# EAGLE design pcb_btt_tmc_2209 (EAGLE 9.6.2)

## Sheet 1 of 4: ESP32
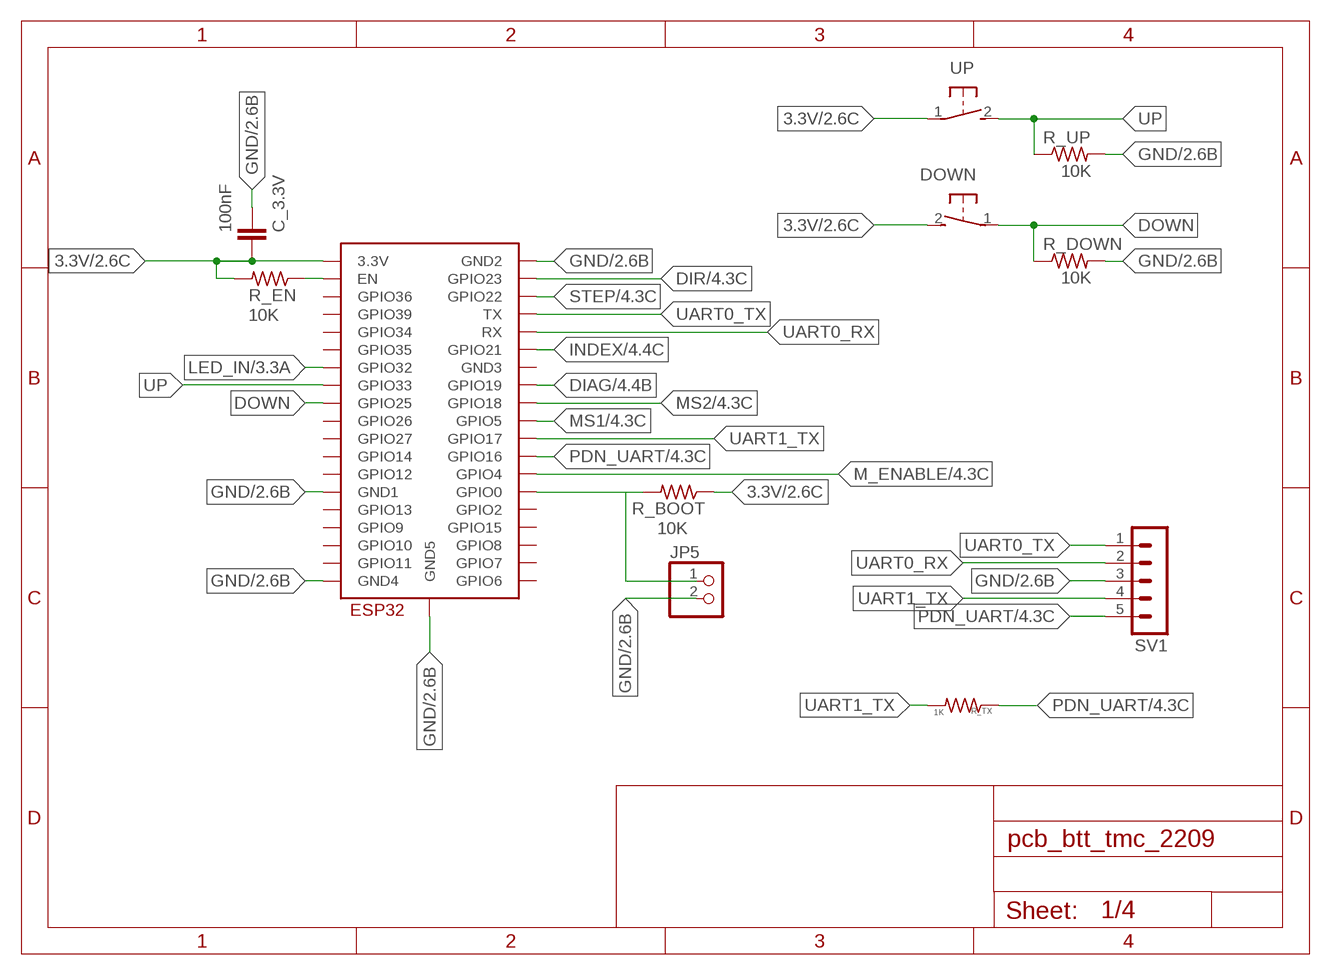
[diagram p0: schematic, sheet 1]

### Parts
C_3.3V  100nF  C-EUC0805K  [C0805K]
DOWN  31-XX  [B3F-31XX]
JP5  PINHD-1X2  [1X02]
R_BOOT  10K  R-US_R0805  [R0805]
R_DOWN  10K  R-US_R0805  [R0805]
R_EN  10K  R-US_R0805  [R0805]
R_TX  1K  R-US_R0805  [R0805]
R_UP  10K  R-US_R0805  [R0805]
SV1  MA05-1  [MA05-1]
U$2  ESP32-WROOM  [ESP32-WROOM]
UP  31-XX  [B3F-31XX]

### Nets
3.3V: C_3.3V.2 DOWN.2(S) R_BOOT.1 R_EN.2 U$2.3V3(3.3V) UP.1(P) ; also sheet 2
DIAG: U$2.IO19(GPIO19) ; also sheet 4
DIR: U$2.IO23(GPIO23) ; also sheet 4
DOWN: DOWN.1(P) R_DOWN.1 U$2.IO25(GPIO25)
GND: C_3.3V.1 JP5.2 R_DOWN.2 R_UP.2 SV1.3 U$2.GND1 U$2.GND2 U$2.GND4 U$2.GND5 ; also sheet 2,3,4
INDEX: U$2.IO21(GPIO21) ; also sheet 4
LED_IN: U$2.IO32(GPIO32) ; also sheet 3
M_ENABLE: U$2.IO4(GPIO4) ; also sheet 4
MS1: U$2.IO5(GPIO5) ; also sheet 4
MS2: U$2.IO18(GPIO18) ; also sheet 4
N$3: JP5.1 R_BOOT.2 U$2.IO0(GPIO0)
N$10: R_EN.1 U$2.EN
PDN_UART: R_TX.1 SV1.5 U$2.IO16(GPIO16) ; also sheet 4
STEP: U$2.IO22(GPIO22) ; also sheet 4
UART0_RX: SV1.2 U$2.RX
UART0_TX: SV1.1 U$2.TX
UART1_TX: R_TX.2 SV1.4 U$2.IO17(GPIO17)
UP: R_UP.1 U$2.IO33(GPIO33) UP.2(S)
Unconnected: U$2.CLK(GPIO6) U$2.CMD(GPIO11) U$2.GND3 U$2.IO2(GPIO2) U$2.IO12(GPIO12) U$2.IO13(GPIO13) U$2.IO14(GPIO14) U$2.IO15(GPIO15) U$2.IO26(GPIO26) U$2.IO27(GPIO27) U$2.IO34(GPIO34) U$2.IO35(GPIO35) U$2.SD0(GPIO7) U$2.SD1(GPIO8) U$2.SD2(GPIO9) U$2.SD3(GPIO10) U$2.SENSOR_VN(GPIO39) U$2.SENSOR_VP(GPIO36)

## Sheet 2 of 4: Power Supply
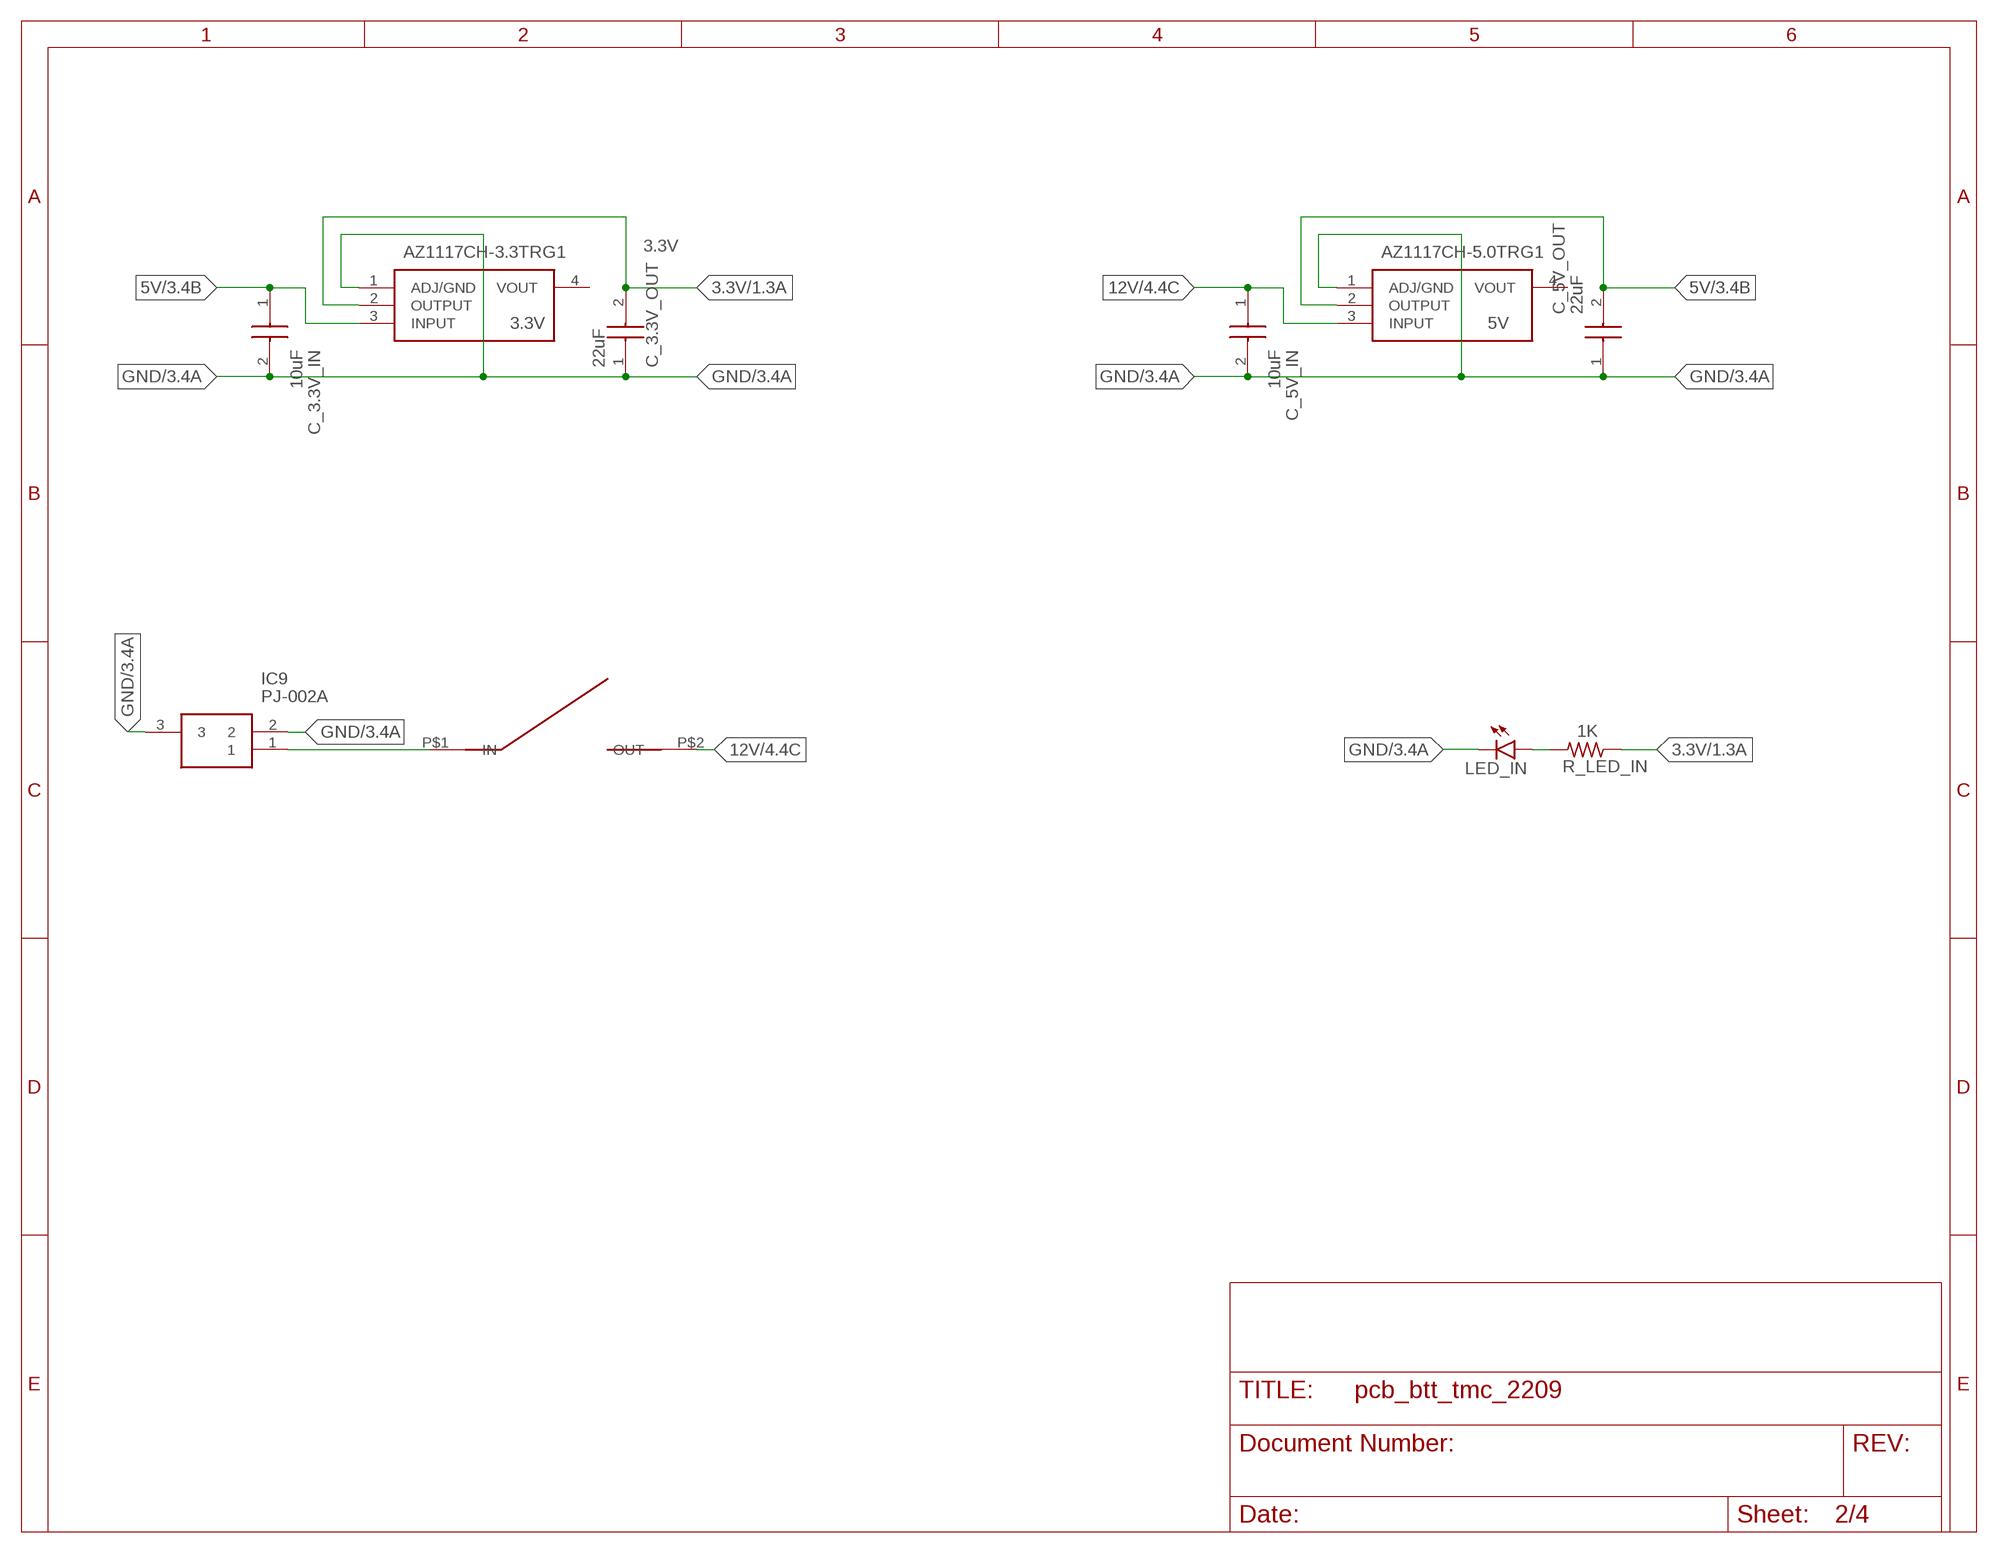
[diagram p1: schematic, sheet 2]

### Parts
3.3V  AZ1117CH-3.3TRG1  [SOT230P700X180-4N]
5V  AZ1117CH-5.0TRG1  [SOT230P700X180-4N]
C_3.3V_IN  10uF  EMK212ABJ106KD-T  [CAPC2013X95N]
C_3.3V_OUT  22uF  CL31A226MOCLNNC  [CAPC3216X100N]
C_5V_IN  10uF  EMK212ABJ106KD-T  [CAPC2013X95N]
C_5V_OUT  22uF  CL31A226MOCLNNC  [CAPC3216X100N]
IC9  PJ-002A  [PJ002A]
LED_IN  LEDSML0805  [SML0805]
R_LED_IN  1K  R-US_R0805  [R0805]
U$1  SPSTROCKERSWITCH2PIN  [SPST2PINROCKER]

### Nets
3.3V: 3.3V.2(OUTPUT) C_3.3V_OUT.2 R_LED_IN.1 ; also sheet 1
5V: 3.3V.3(INPUT) 5V.2(OUTPUT) C_3.3V_IN.1 C_5V_OUT.2 ; also sheet 3,4
12V: 5V.3(INPUT) C_5V_IN.1 U$1.P$2(OUT) ; also sheet 4
GND: 3.3V.1(ADJ/GND) 5V.1(ADJ/GND) C_3.3V_IN.2 C_3.3V_OUT.1 C_5V_IN.2 C_5V_OUT.1 IC9.2 IC9.3 LED_IN.C ; also sheet 1,3,4
N$1: IC9.1 U$1.P$1(IN)
N$2: LED_IN.A R_LED_IN.2
Unconnected: 3.3V.4(VOUT) 5V.4(VOUT)

## Sheet 3 of 4: LED/LEVELSHIFTER
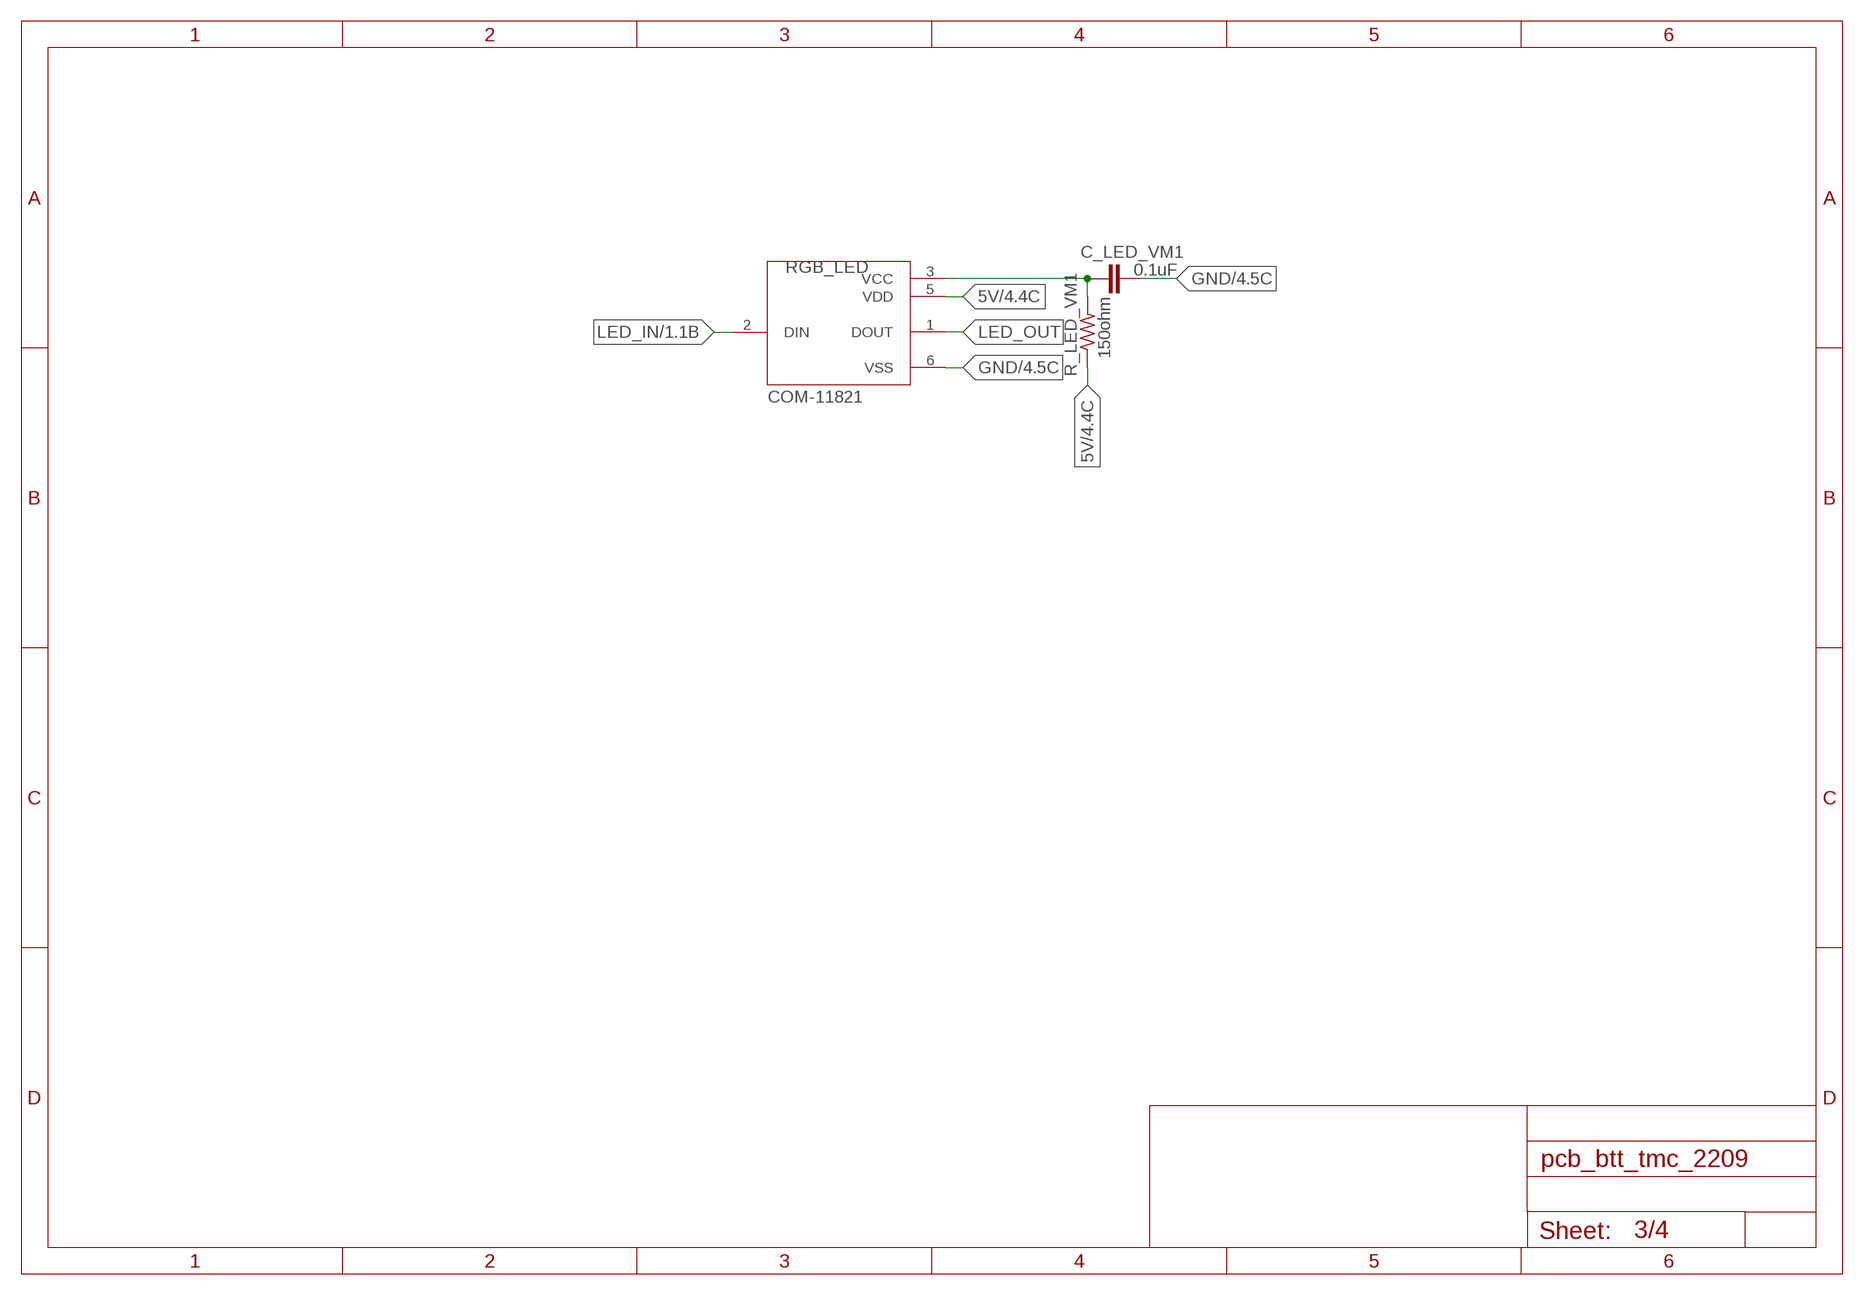
[diagram p2: schematic, sheet 3]

### Parts
C_LED_VM1  0.1uF  C-EUC0805K  [C0805K]
R_LED_VM1  150ohm  R-US_R0805  [R0805]
RGB_LED  COM-11821  [LED_COM-11821]

### Nets
5V: R_LED_VM1.1 RGB_LED.5(VDD) ; also sheet 2,4
GND: C_LED_VM1.2 RGB_LED.6(VSS) ; also sheet 1,2,4
LED_IN: RGB_LED.2(DIN) ; also sheet 1
LED_OUT: RGB_LED.1(DOUT)
N$4: C_LED_VM1.1 R_LED_VM1.2 RGB_LED.3(VCC)

## Sheet 4 of 4: BTT MODULE TMC2209LA
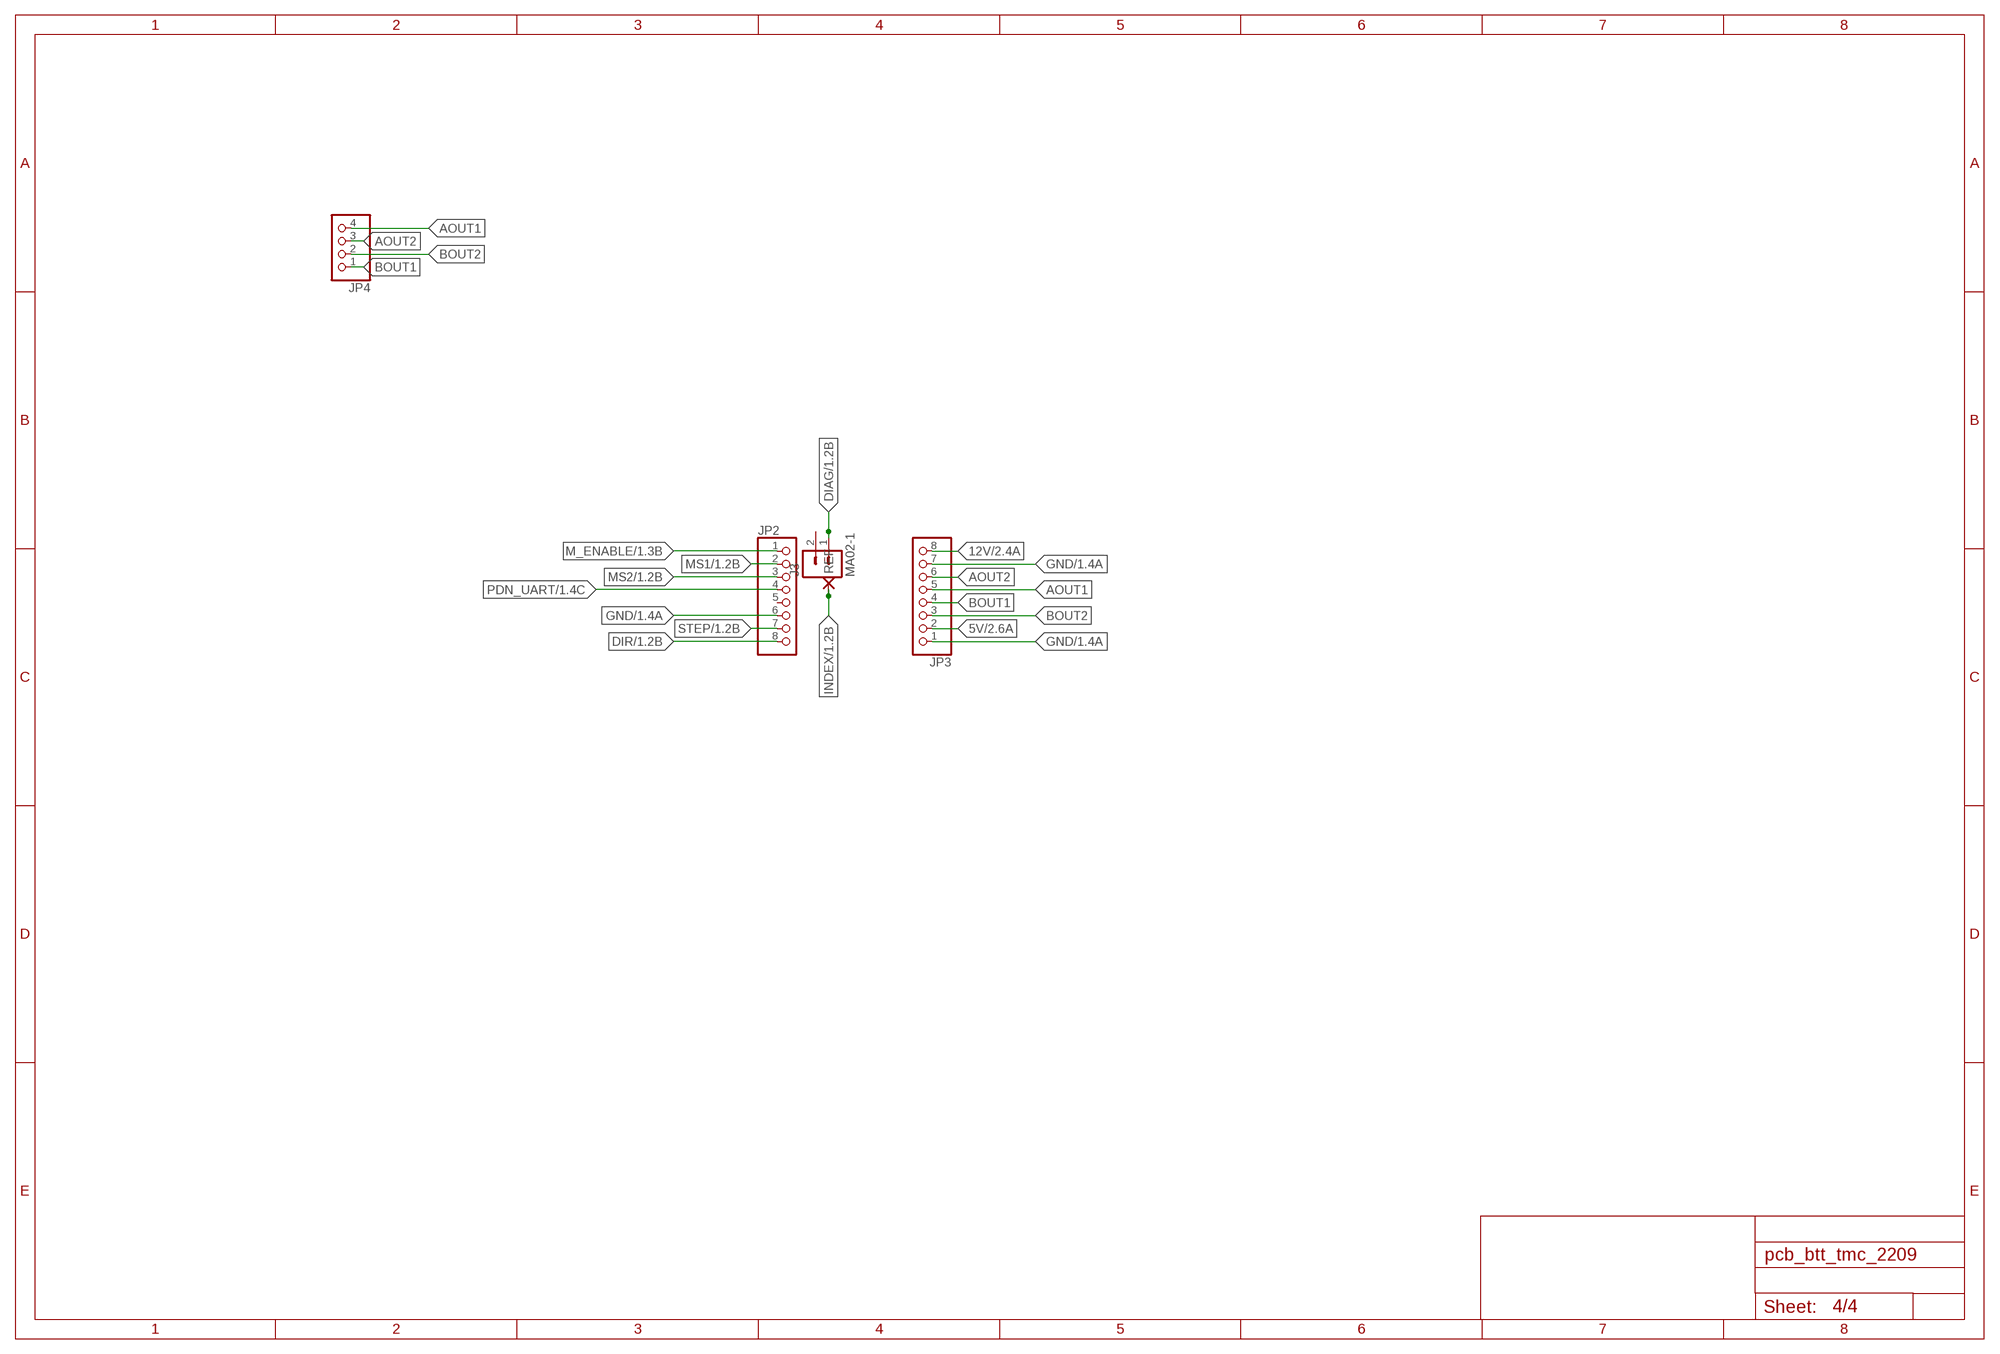
[diagram p3: schematic, sheet 4]

### Parts
J3  MA02-1  [MA02-1]
JP2  PINHD-1X8  [1X08]
JP3  PINHD-1X8  [1X08]
JP4  PINHD-1X4  [1X04]
REF  PAD-0.6-1.1  [PAD-0.6-1.1]

### Nets
5V: JP3.2 ; also sheet 2,3
12V: JP3.8 ; also sheet 2
AOUT1: JP3.5 JP4.4
AOUT2: JP3.6 JP4.3
BOUT1: JP3.4 JP4.1
BOUT2: JP3.3 JP4.2
DIAG: J3.1 ; also sheet 1
DIR: JP2.8 ; also sheet 1
GND: JP2.6 JP3.1 JP3.7 ; also sheet 1,2,3
INDEX: REF.1(P) ; also sheet 1
M_ENABLE: JP2.1 ; also sheet 1
MS1: JP2.2 ; also sheet 1
MS2: JP2.3 ; also sheet 1
PDN_UART: JP2.4 ; also sheet 1
STEP: JP2.7 ; also sheet 1
Unconnected: J3.2 JP2.5

## Library data of the parts
3.3V = SamacSys_Parts:AZ1117CH-3.3TRG1: 1.35A 3.3V LDO Reg. Current Limit SOT223 DiodesZetex AZ1117CH-3.3TRG1, LDO Voltage Regulator, 0.8A, 3.3 V +/-1%, maximum of 15 Vin, 3-Pin SOT-223 Source: Datasheet <https://datasheet.datasheetarchive.com/originals/distributors/Datasheets-DGA25/1776204.pdf>; DESCRIPTION: 1.35A 3.3V LDO Reg. Current Limit SOT223 DiodesZetex AZ1117CH-3.3TRG1, LDO Voltage Regulator, 0.8A, 3.3 V +/-1%, maximum of 15 Vin, 3-Pin SOT-223; HEIGHT: 1.8mm; MANUFACTURER_NAME: Diodes Inc.; MANUFACTURER_PART_NUMBER: AZ1117CH-3.3TRG1; MOUSER_PART_NUMBER: 621-AZ1117CH-3.3TRG1; MOUSER_PRICE-STOCK: https://www.mouser.co.uk/ProductDetail/Diodes-Incorporated/AZ1117CH-33TRG1?qs=FKu9oBikfSm7ntaG6olPSQ%3D%3D
5V = SamacSys_Parts:AZ1117CH-5.0TRG1: DiodesZetex AZ1117CH-5.0TRG1, LDO Regulator, 300mA, 5 V, +/-1% 3+Tab-Pin, SOT-223 Source: Datasheet <https://www.diodes.com/assets/Datasheets/AZ1117C.pdf>; DESCRIPTION: DiodesZetex AZ1117CH-5.0TRG1, LDO Regulator, 300mA, 5 V, +/-1% 3+Tab-Pin, SOT-223; HEIGHT: 1.8mm; MANUFACTURER_NAME: Diodes Inc.; MANUFACTURER_PART_NUMBER: AZ1117CH-5.0TRG1; MOUSER_PART_NUMBER: 621-AZ1117CH-5.0TRG1; MOUSER_PRICE-STOCK: https://www.mouser.co.uk/ProductDetail/Diodes-Incorporated/AZ1117CH-50TRG1?qs=FKu9oBikfSlJYUAtiuMgOw%3D%3D
C_3.3V C_LED_VM1 = rcl:C-EU: CAPACITOR, European symbol; SPICEPREFIX: C
C_3.3V_IN C_5V_IN = SamacSys_Parts:EMK212ABJ106KD-T: Taiyo Yuden 0805 (2012M) 10uF Multilayer Ceramic Capacitor MLCC 16V dc +/-10% SMD EMK212ABJ106KD-T Source: Datasheet <https://ds.yuden.co.jp/TYCOMPAS/ut/detail?pn=EMK212ABJ106KD-T &u=M>; DESCRIPTION: Taiyo Yuden 0805 (2012M) 10uF Multilayer Ceramic Capacitor MLCC 16V dc +/-10% SMD EMK212ABJ106KD-T; HEIGHT: 0.95mm; MANUFACTURER_NAME: TAIYO YUDEN; MANUFACTURER_PART_NUMBER: EMK212ABJ106KD-T; MOUSER_PART_NUMBER: 963-EMK212ABJ106KD-T; MOUSER_PRICE-STOCK: https://www.mouser.co.uk/ProductDetail/Taiyo-Yuden/EMK212ABJ106KD-T?qs=I6KAKw0tg2yYKujEsK8opA%3D%3D
C_3.3V_OUT C_5V_OUT = SamacSys_Parts:CL31A226MOCLNNC: Ceramic capacitor 1206 X5R 16V 22uF Samsung Electro-Mechanics 1206 CL 22uF Ceramic Multilayer Capacitor, 16 V, +85C, X5R Dielectric, +/-20% SMD Source: Datasheet <https://datasheet.datasheetarchive.com/originals/distributors/Datasheets_SAMA/f725fe7da06092c10c109ee50d712988.pdf>; DESCRIPTION: Ceramic capacitor 1206 X5R 16V 22uF Samsung Electro-Mechanics 1206 CL 22uF Ceramic Multilayer Capacitor, 16 V, +85C, X5R Dielectric, +/-20% SMD; HEIGHT: 1mm; MANUFACTURER_NAME: Samsung Electro-Mechanics; MANUFACTURER_PART_NUMBER: CL31A226MOCLNNC; MOUSER_PART_NUMBER: 187-CL31A226MOCLNNC; MOUSER_PRICE-STOCK: https://www.mouser.co.uk/ProductDetail/Samsung-Electro-Mechanics/CL31A226MOCLNNC?qs=X6jEic%2FHinD7wddQJyY%252BZw%3D%3D
DOWN UP = switch-omron:31-XX: OMRON SWITCH; MPN: B3F-3100; OC_FARNELL: 959704; OC_NEWARK: 36M3582
IC9 = SamacSys_Parts:PJ-002A: CONN PWR JACK 2X5.5MM SOLDER Source: Datasheet <https://www.cui.com/product/resource/digikeypdf/pj-002a.pdf>; DESCRIPTION: CONN PWR JACK 2X5.5MM SOLDER; HEIGHT: 11mm; MANUFACTURER_NAME: CUI Inc.; MANUFACTURER_PART_NUMBER: PJ-002A; MOUSER_PART_NUMBER: 490-PJ-002A; MOUSER_PRICE-STOCK: https://www.mouser.co.uk/ProductDetail/CUI-Devices/PJ-002A?qs=WyjlAZoYn51CKfAix9Mngw%3D%3D
J3 = we-con:MA02-1: Pin Header
JP2 JP3 = pinhead:PINHD-1X8: PIN HEADER
JP4 = pinhead:PINHD-1X4: PIN HEADER
JP5 = pinhead:PINHD-1X2: PIN HEADER
LED_IN = led:LED: LED OSRAM: - CHIPLED LG R971, LG N971, LY N971, LG Q971, LY Q971, LO R971, LY R971 LH N974, LH R974 LS Q976, LO Q976, LY Q976 LO Q996 - Hyper CHIPLED LW Q18S LB Q993, LB Q99A, LB R99A - SideLED LS A670, LO A670, LY A670, LG A670, LP A670 LB A673, LV A673, LT A673, LW A673 LH A674 LY A675 LS A676, LA A676, LO A676, LY A676, LW A676 LS A679, LY A679, LG A679 - Hyper Micro SIDELED® LS Y876, LA Y876, LO Y876, LY Y876 LT Y87S - SmartLED LW L88C, LW L88S LB L89C, LB L89S, LG L890 LS L89K, LO L89K, LY L89K LS L896, LA L896, LO L896, LY L896 - TOPLED LS T670, LO T670, LY T670, LG T670, LP T670 LSG T670, LSP T670, LSY T670, LOP T670, LYG T670 LG T671, LOG T671, LSG T671 LB T673, LV T673, LT T673, LW T673 LH T674 LS T676, LA T676, LO T676, LY T676, LB T676, LH T676, LSB T676, LW T676 LB T67C, LV T67C, LT T67C, LS T67K, LO T67K, LY T67K, LW E67C LS E67B, LA E67B, LO E67B, LY E67B, LB E67C, LV E67C, LT E67C LW T67C LS T679, LY T679, LG T679 LS T770, LO T770, LY T770, LG T770, LP T770 LB T773, LV T773, LT T773, LW T773 LH T774 LS E675, LA E675, LY E675, LS T675 LS T776, LA T776, LO T776, LY T776, LB T776 LHGB T686 LT T68C, LB T68C - Hyper Mini TOPLED® LB M676 - Mini TOPLED Santana® LG M470 LS M47K, LO M47K, LY M47K Source: http://www.osram.convergy.de LUXEON: - LUMILED® LXK2-PW12-R00, LXK2-PW12-S00, LXK2-PW14-U00, LXK2-PW14-V00 LXK2-PM12-R00, LXK2-PM12-S00, LXK2-PM14-U00 LXK2-PE12-Q00, LXK2-PE12-R00, LXK2-PE12-S00, LXK2-PE14-T00, LXK2-PE14-U00 LXK2-PB12-K00, LXK2-PB12-L00, LXK2-PB12-M00, LXK2-PB14-N00, LXK2-PB14-P00, LXK2-PB14-Q00 LXK2-PR12-L00, LXK2-PR12-M00, LXK2-PR14-Q00, LXK2-PR14-R00 LXK2-PD12-Q00, LXK2-PD12-R00, LXK2-PD12-S00 LXK2-PH12-R00, LXK2-PH12-S00 LXK2-PL12-P00, LXK2-PL12-Q00, LXK2-PL12-R00 Source: www.luxeon.com KINGBRIGHT: KA-3528ASYC Source: www.kingbright.com
R_BOOT R_DOWN R_EN R_LED_IN R_LED_VM1 R_TX R_UP = rcl:R-US_: RESISTOR, American symbol; SPICEPREFIX: R
REF = we-rcl:PAD: Pad / Test-Point
RGB_LED = COM-11821:COM-11821: Led - Smd Rgb (Ws2812) Check prices <https://pricing.snapeda.com/parts/COM-11821/SparkFun%20Electronics/view-part?ref=eda>; AVAILABILITY: In Stock; DESCRIPTION: Addressable Lighting series 1 LED Discrete Serial (Shift Register) Red, Green, Blue (RGB) 5.00mm L x 5.00mm W; MF: SparkFun Electronics; MP: COM-11821; PACKAGE: DIP-18 SparkFun Electronics; PRICE: None; PURCHASE-URL: https://pricing.snapeda.com/search/part/COM-11821/?ref=eda
SV1 = con-lstb:MA05-1: PIN HEADER; OC_FARNELL: unknown; OC_NEWARK: unknown
U$1 = spstrocker2pin:SPSTROCKERSWITCH2PIN
U$2 = ESP32_v2:ESP32-WROOM

## Board
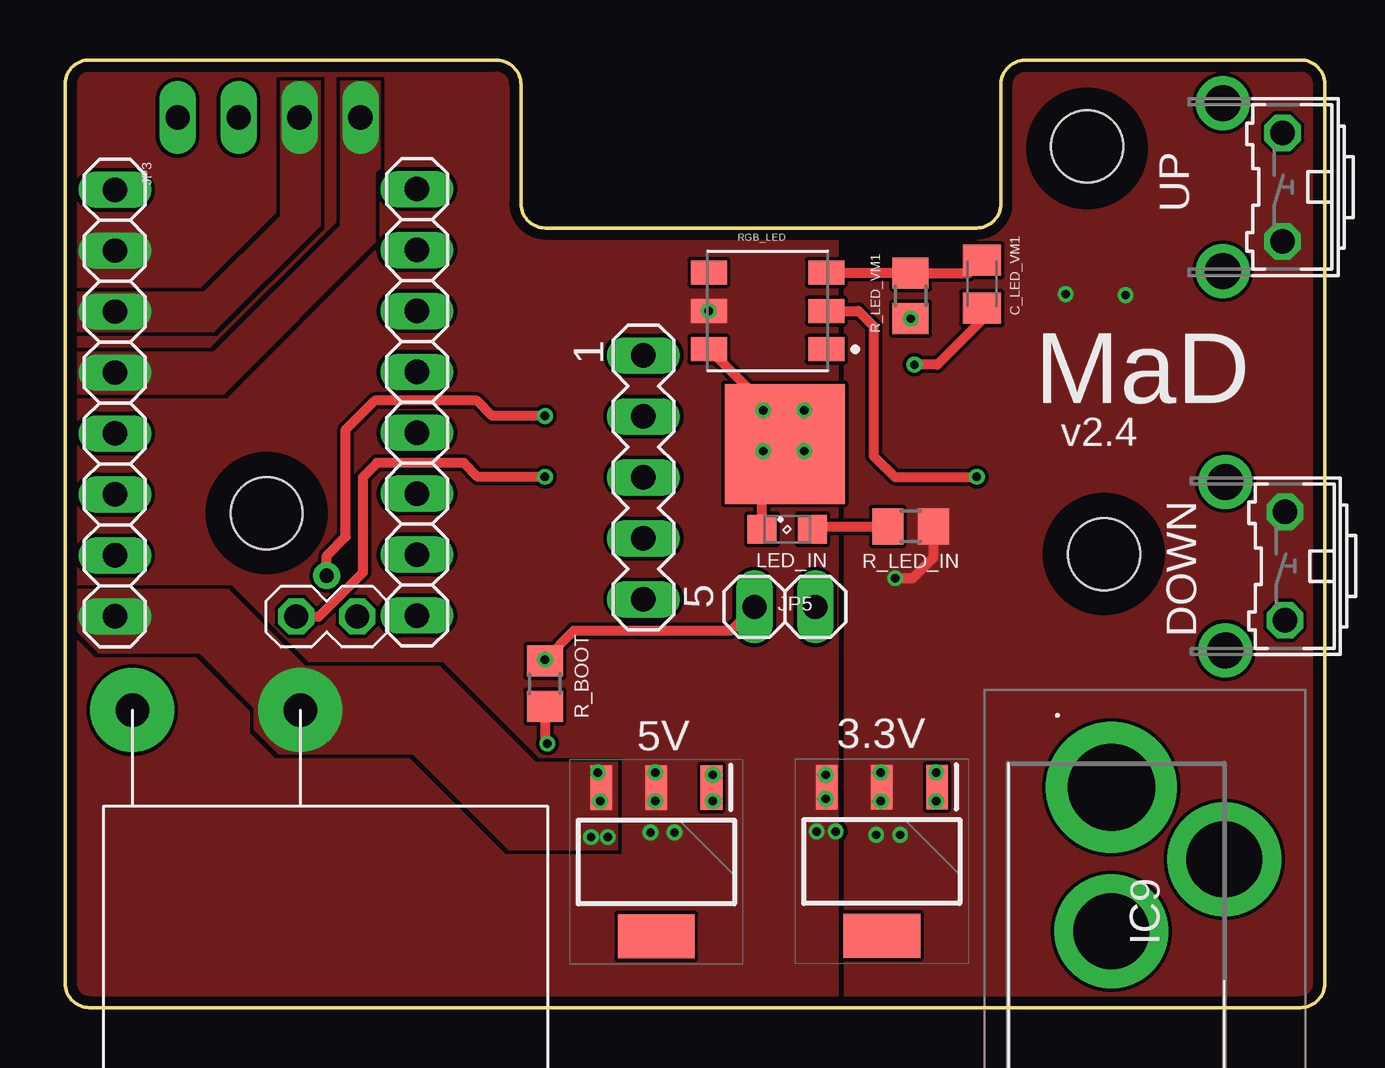
[diagram p4: board, top side]
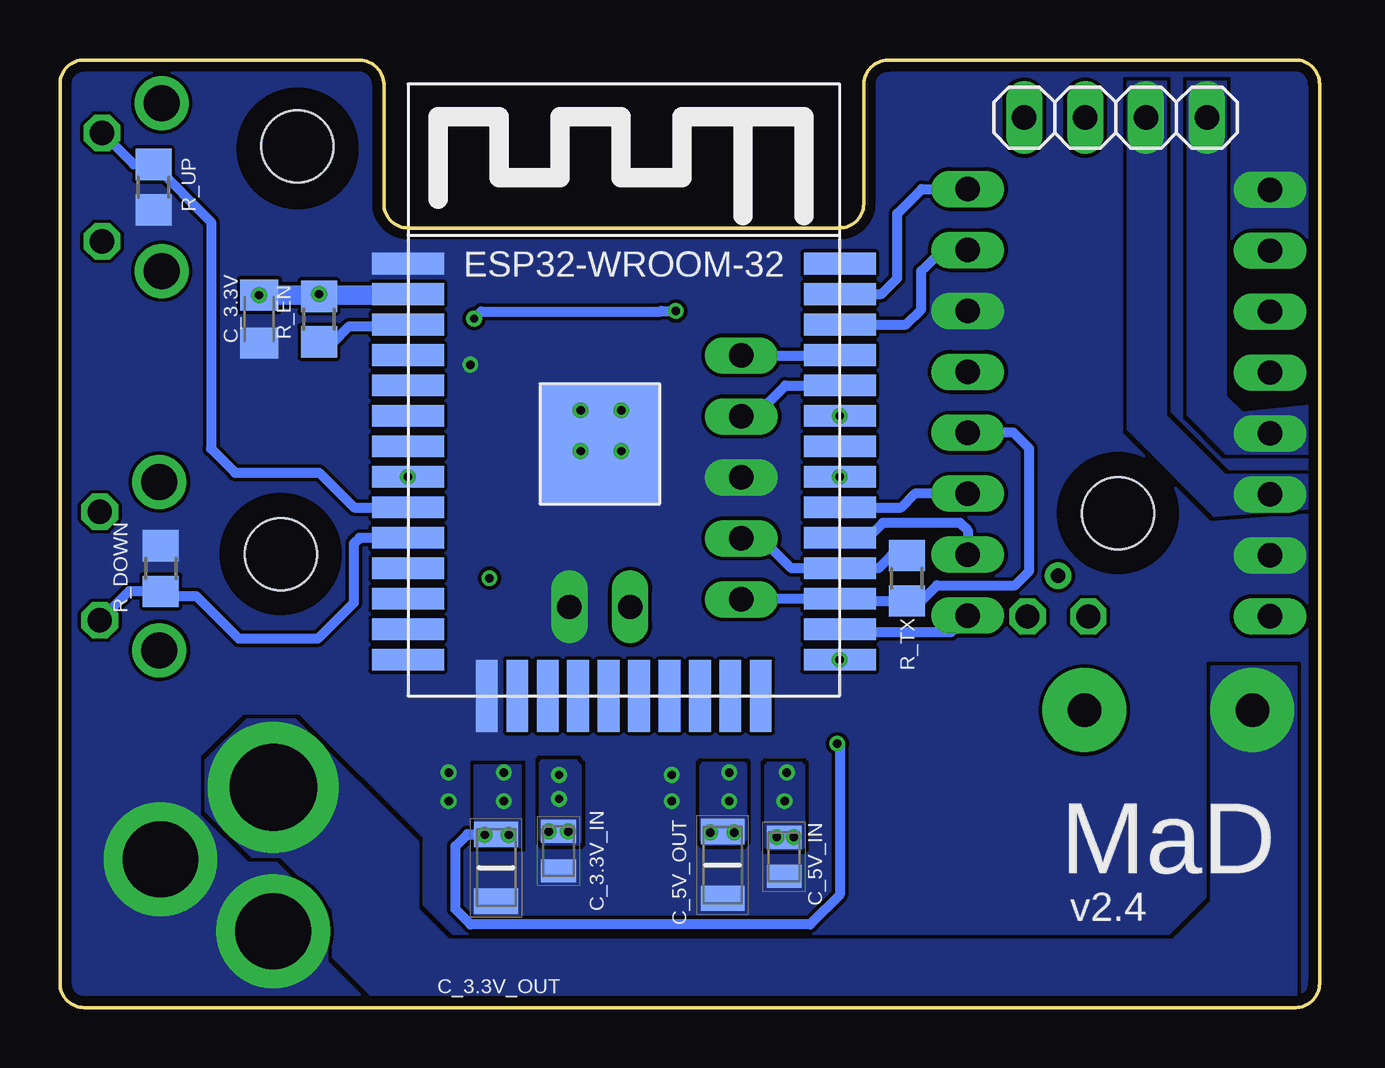
[diagram p5: board, bottom side, seen from below]

Size 52.5 x 39.5 mm. Coordinates in mm from the lower left corner, seen from the top.
Outline: 1,0 51.5,0 arc90 52.5,1 52.5,38.5 arc90 51.5,39.5 40.1,39.5 arc90 39,38.5 39,33.5 arc-90 38,32.5 20,32.5 arc-90 19,33.5 19,38.5 arc90 17.9,39.5 1,39.5 arc90 0,38.5 0,1 arc90 1,0
Copper layers (1*16): Top 0.035mm / dielectric 0.35mm / Bottom 0.035mm
Design rules "default *": minimum track width 0.15mm, minimum drill 0.25mm, track to track 0.15mm, track to pad 0.15mm, pad to pad 0.15mm, via to via 0.15mm, smd to smd 0mil, copper to edge 0.4mm, drill to drill 8mil, minimum pad ring 10mil, minimum via ring 6mil, stop-mask expansion 2mil, vias tented up to drill 0.5mm, thermal gap 10mil
Holes 3 mm at 8.4,20.61 43.3,18.9 42.6,35.9
tRestrict: area 5.9,18.1 to 10.9,23.1; area 40.8,16.4 to 45.8,21.4; area 40.1,33.3 to 45.1,38.3
bRestrict: area 5.9,18.1 to 10.9,23.1; area 40.8,16.4 to 45.8,21.4; area 40.1,33.3 to 45.1,38.3

### Footprints (pad centres in the part's own frame; a part is rotated, then mirrored left to right if it is on the bottom)
SOT230P700X180-4N = smd 1.85 x 0.9: 1 -3.1,2.3; 2 -3.1,0; 3 -3.1,-2.3 | smd 1.85 x 3.2: 4 3.1,0
C0805K = smd 1.3 x 1.6: 1 -1,0; 2 1,0
CAPC2013X95N = smd 0.96 x 1.44: 1 -0.82,0; 2 0.82,0
CAPC3216X100N = smd 1.05 x 1.82: 1 -1.39,0; 2 1.39,0
B3F-31XX = drill 1.016 octagon: 1 -2.261,-1.245; 2 2.261,-1.245 | drill 1.499 pad 2.159: 3 -3.505,1.245; 4 3.505,1.245
PJ002A = drill 3.64 pad 5.46: 1 0,0 | drill 3.16 pad 4.74: 2 -6,0; 3 -3,-4.7
MA02-1 = drill 1 octagon: 1 0,1.27; 2 0,-1.27
1X08 = drill 1.016 long: 1 -8.89,0; 2 -6.35,0; 3 -3.81,0; 4 -1.27,0; 5 1.27,0; 6 3.81,0; 7 6.35,0; 8 8.89,0
1X04 = drill 1.016 long: 1 -3.81,0; 2 -1.27,0; 3 1.27,0; 4 3.81,0
1X02 = drill 1.016 long: 1 -1.27,0; 2 1.27,0
SML0805 = smd 1.2 x 1.2: A 1.05,0; C -1.05,0
R0805 = smd 1.3 x 1.5: 1 -0.95,0; 2 0.95,0
PAD-0.6-1.1 = drill 0.6 pad 1.1: 1 0,0
LED_COM-11821 = smd 1.5 x 1: 1 -2.45,1.6; 2 -2.45,0; 3 -2.45,-1.6; 4 2.45,-1.6; 5 2.45,0; 6 2.45,1.6
MA05-1 = drill 1.016 long: 1 -5.08,0; 2 -2.54,0; 3 0,0; 4 2.54,0; 5 5.08,0
SPST2PINROCKER = drill 1.4 pad 3.5: P$1 0,0; P$2 7,0
ESP32-WROOM = smd 3 x 0.9: 3V3 0,16.74; EN 0,15.47; GND1 0,18.01; GND3 18,18.01; IO0 18,1.5; IO4 18,2.77; IO5 18,6.58; IO12 0,1.5; IO14 0,2.77; IO16 18,4.04; IO17 18,5.31; IO18 18,7.85; IO19 18,9.12; IO21 18,11.66; IO22 18,15.47; IO23 18,16.74; IO25 0,6.58; IO26 0,5.31; IO27 0,4.04; IO32 0,9.12; IO33 0,7.85; IO34 0,11.66; IO35 0,10.39; NC 18,10.39; RX 18,12.93; SENSOR_VN 0,12.93; SENSOR_VP 0,14.2; TX 18,14.2 | smd 0.9 x 3: CLK 9.635,0; CMD 8.365,0; GND2 3.285,0; IO2 14.715,0; IO13 4.555,0; IO15 13.445,0; SD0 10.905,0; SD1 12.175,0; SD2 5.825,0; SD3 7.095,0 | smd 5 x 5: GND4 8,10.5 | smd 5 x 5 bottom: GND5 8,10.5

### Placement (x,y rotation side)
3.3V  34.04,6.09 270 top
5V  24.64,6.07 270 top
C_3.3V  44.2,28.7 90 bottom
C_3.3V_IN  31.72,6.52 270 bottom
C_3.3V_OUT  34.32,5.83 90 bottom
C_5V_IN  22.32,6.28 270 bottom
C_5V_OUT  24.88,5.94 90 bottom
C_LED_VM1  38.21,30.16 270 top
DOWN  49.6,18.4 90 top
IC9  43.61,9.18 90 top
J3  10.9,16.3 90 top
JP2  14.66,25.23 90 top
JP3  2.07,25.2 270 top
JP4  8.5,37.1 0 bottom
JP5  30,16.7 0 top
LED_IN  30.1,19.94 0 top
R_BOOT  20,13.5 90 top
R_DOWN  48.3,18.3 90 bottom
R_EN  41.7,28.7 90 bottom
R_LED_IN  35.24,20.06 180 top
R_LED_VM1  35.24,29.67 90 top
R_TX  17.2,17.9 90 bottom
R_UP  48.6,34.2 270 bottom
REF  10.9,18 0 top
RGB_LED  29.28,29.04 180 top
SV1  24.1,22.1 270 top
U$1  2.8,12.4 0 top
U$2  38,13 0 bottom
UP  49.5,34.2 90 top

### Tracks (layer width: path | path; a pad name or v marks a point on that pad's centre or on a via)
3.3V  (via drill 0.35)
  Top 0.406: R_LED_IN.1 36.19,18.76 35.33,17.9 v34.6,17.9 | v34,9.8 34,9.23 3.3V.2 34.04,8.64 v34,8.6 | R_BOOT.1 20,11.1 v20.1,11
  Bottom 0.15: v41.7,29.74 R_EN.2
  Bottom 0.406: U$2.3V3 v41.7,29.74 41.8,29.64 44.14,29.64 C_3.3V.2 44.05,29.85 | v33.8,7.2 34.3,7.2 C_3.3V_OUT.2 35.52,7.22 36.02,6.72 36.02,4.1 35.39,3.47 21.23,3.47 20,4.7 20,10.9 v20.1,11
  Bottom 0.61: U$2.3V3 43.94,29.74 44.05,29.85
  Bottom 0.813: C_3.3V.2 38.04,29.7 U$2.3V3
  other vias: 44.2,29.7 34.8,7.2
  pour Top (rank 2, no thermals): 32.5,40.1 32.5,-0.6 52.2,-0.6 53.2,0.4 53.2,39.1 52.2,40.1
  pour Top (no thermals): 33.3,10.2 33.3,6.8 33.4,6.7 35.2,6.7 35.2,10.2
  pour Bottom (no thermals): 33.3,10.1 33.3,6.7 35.2,6.7 35.2,10.1
5V  (via drill 0.35)
  Top 0.406: v24.6,9.8 24.64,9.76 5V.2 24.64,8.64 v24.6,8.6 | v31.7,9.7 31.7,9.23 3.3V.3 31.74,8.74 v31.7,8.7
  Bottom 0.406: 26.9,29 26.86,29.04 RGB_LED.5 27.43,29.04 27.45,29.02 34.94,29.02 R_LED_VM1.1 | C_5V_OUT.2 24.43,7.33 | 24.43,7.33 v24.4,7.3 | C_5V_OUT.2 25.37,7.33 v25.4,7.3 | 24.3,7.46 24.43,7.33 | C_5V_OUT.2 24.6,7.61 | C_3.3V_IN.1 v32.12,7.34
  other vias: 26.83,29.04 35.24,28.72 31.32,7.34
  pour Top (rank 2, no thermals): -0.7,39.1 0.3,40.1 32,40.1 32.2,40.3 32.2,-0.6 0.5,-0.6 -0.7,0.6
  pour Top (no thermals): 23.9,7 24,6.9 24.1,6.8 25.6,6.8 25.8,7 25.8,7.5 25.8,10.1 25.7,10.2 24,10.2 23.9,10.1
  pour Bottom (no thermals): 23.9,7 24.1,6.8 25.6,6.8 25.8,7 25.8,10.1 25.7,10.2 24,10.2 23.9,10.1
  pour Bottom (no thermals): 30.8,6.9 30.9,6.8 32.2,6.8 32.3,6.8 32.5,7 32.5,10.2 32.4,10.3 31,10.3 30.8,10.1
12V  (via drill 0.35)
  Top 0.406: v22.2,9.8 22.34,9.66 5V.3 22.34,8.64 v22.3,8.6
  Bottom 0.406: v21.92,7.1 22.2,7.38 22.2,7.22 C_5V_IN.1
  other vias: 22.62,7.1
  pour Top (no thermals): 0.4,17.4 0.4,15.8 1.4,14.8 5.6,14.8 7.9,12.5 7.9,11.6 8.9,10.6 14.5,10.6 18.5,6.6 23,6.6 23,10.2 19.6,10.2 15.6,14.2 10,14.2 6.8,17.4
  pour Bottom (no thermals): 23.1,6.7 23,6.6 21.6,6.6 21.5,6.7 21.5,10.1 21.6,10.2 23,10.2 23.1,10.1
AOUT1
  pour Bottom (no thermals): 3.9,38.6 3.9,25.5 3.2,24.8 0.4,25.1 0.4,23.1 3.9,23.1 5.5,24.7 5.5,35.7 5.5,35.7 5.5,38.6
AOUT2
  pour Bottom (no thermals): 3.93,22.2 6.4,24.67 6.4,38.6 8,38.6 8,24.1 4.4,20.5 0.4,20.8 0.4,22.2
BOUT1
  Top 0.15: 12.91,37.46 12.91,37.1
  pour Top (no thermals): 0.4,27.3 6.2,27.3 11.5,32.6 11.5,38.6 13.1,38.6 13.1,35 12.9,34.8 12.9,31.9 6.6,25.6 0.4,25.6
BOUT2
  pour Top (no thermals): 0.4,29.8 5.8,29.8 9,33 9,38.6 10.6,38.6 10.6,32.6 6.2,28.2 0.4,28.2
DIAG  (via drill 0.35)
  Top 0.406: U$2.IO19 17.2,22.12 16.62,22.7 13,22.7 12.4,22.1 12.4,18.12 10.58,16.3 J3.1
  other vias: 20,22.12
DIR
  Bottom 0.406: U$2.IO23 18.26,29.74 17.6,30.4 17.6,33.1 16.58,34.12 JP2.8
DOWN
  Bottom 0.406: DOWN.1 49.63,17.35 R_DOWN.1 48.1,17.15 46.82,17.15 45.03,15.37 41.77,15.37 40.26,16.88 40.26,19.34 40.02,19.58 U$2.IO25
GND  (via drill 0.35)
  Top 0.15: U$2.GND4 30.5,23.5 v30.8,23.2
  Top 0.406: C_LED_VM1.2 38.21,28.66 36.35,26.8 v35.4,26.8 | RGB_LED.6 29.1,25.17 v29.1,24.9 v29.1,23.2 29.7,23.2 U$2.GND4 29.05,22.55 29.05,22.15 | LED_IN.C 29.05,22.15 | 29.05,22.15 28.9,22.3 28.95,22.35 | v27,9.7 26.94,9.64 5V.1 26.94,8.66 v27,8.6 | v36.3,9.8 36.34,9.76 3.3V.1 36.34,8.64 v36.3,8.6
  Bottom 0.15: v29.1,24.9 29.1,24.4 U$2.GND4 30,24.1 v30.8,24.9
  Bottom 0.406: v29.1,23.2 29.1,23.5 | 24.2,4.6 24.25,4.55 C_5V_OUT.1 24.93,4.6 | 33.7,4.5 33.76,4.44 C_3.3V_OUT.1 34.94,4.44 35,4.5
  pour Bottom (rank 6, no thermals): -0.4,39.1 0.4,39.9 52.1,39.9 53,39 53,0.5 52.1,-0.4 0.6,-0.4 -0.4,0.6
INDEX  (via drill 0.35)
  Top 0.406: REF.1 10.9,18.83 11.7,19.63 11.7,24.1 12.9,25.3 17.16,25.3 17.8,24.66 U$2.IO21
  other vias: 20,24.66
LED_IN  (via drill 0.35)
  Top 0.406: RGB_LED.2 33.06,29.04 33.7,28.4 33.7,23 34.58,22.12 U$2.IO32
  other vias: 38,22.12
M_ENABLE
  Bottom 0.406: U$2.IO4 19.88,15.65 15.35,15.65 JP2.1
MS1
  Bottom 0.406: U$2.IO5 18.82,19.58 18.2,20.2 14.98,20.2 14.66,19.88 JP2.2
MS2
  Bottom 0.406: JP2.3 16.86,21.42 17.43,20.85 U$2.IO18
N$1
  pour Bottom (no thermals): 1,14.2 1,0.2 39.2,0.2 41.1,2.1 41.1,4.1 43.3,6.3 44.5,6.3 46.4,8.2 46.4,10.3 44.7,12 42.7,12 37.6,6.9 37.6,4.1 36.3,2.8 6.1,2.8 4.5,4.4 4.5,14.2
N$2
  Top 0.406: LED_IN.A 31.27,20.06 R_LED_IN.2
N$3  (via drill 0.35)
  Top 0.406: R_BOOT.2 U$2.IO0 21.2,15.7 27.73,15.7 JP5.1
  other vias: 20,14.5
N$4
  Top 0.406: RGB_LED.3 35.22,30.64 R_LED_VM1.2 37.67,30.62 C_LED_VM1.1
N$10
  Bottom 0.406: R_EN.1 41.1,27.75 40.45,28.4 38.07,28.4 U$2.EN
PDN_UART
  Bottom 0.406: SV1.5 24.08,17.04 U$2.IO16 19.91,16.95 R_TX.1 16.6,16.95 15.95,17.6 12.7,17.6 12.1,18.2 12.1,23.3 12.76,23.96 JP2.4
STEP
  Bottom 0.406: U$2.IO22 17.23,28.47 16.6,29.1 16.6,30.7 15.72,31.58 JP2.7
UART0_RX
  Bottom 0.406: SV1.2 23.56,24.64 22.27,25.93 U$2.RX
UART0_TX
  Bottom 0.406: SV1.1 20.02,27.18 U$2.TX
UART1_TX
  Bottom 0.406: SV1.4 23.26,19.56 22.01,18.31 U$2.IO17 18.39,18.31 17.85,18.85 R_TX.2
UP
  Bottom 0.406: UP.2 49.43,35.15 R_UP.1 46.2,32.75 46.2,23.3 45.2,22.3 41.7,22.3 40.25,20.85 U$2.IO33

### Text on the board
tNames: MaD | v2.4
bNames: MaD | v2.4